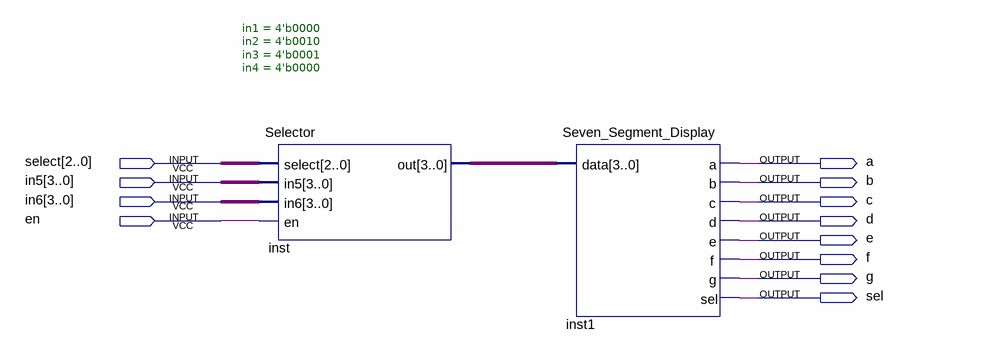
[diagram p0: schematic sheet]
// Quartus schematic Block1.bdf as structural Verilog: 2 symbols, 12 pins
module Block1 (
  input  [2:0] select,
  input  [3:0] in5,
  input  [3:0] in6,
  input  en,
  output a,
  output b,
  output c,
  output d,
  output e,
  output f,
  output g,
  output sel
);

  wire [3:0] inst_out;

  Selector #(.in1(4'b0000), .in2(4'b0010), .in3(4'b0001), .in4(4'b0000)) inst (
    .select(select), .in5(in5), .in6(in6), .en(en), .out(inst_out));
  Seven_Segment_Display inst1 (.data(inst_out), .a(a), .b(b), .c(c), .d(d), .e(e), .f(f), .g(g), .sel(sel));
endmodule
